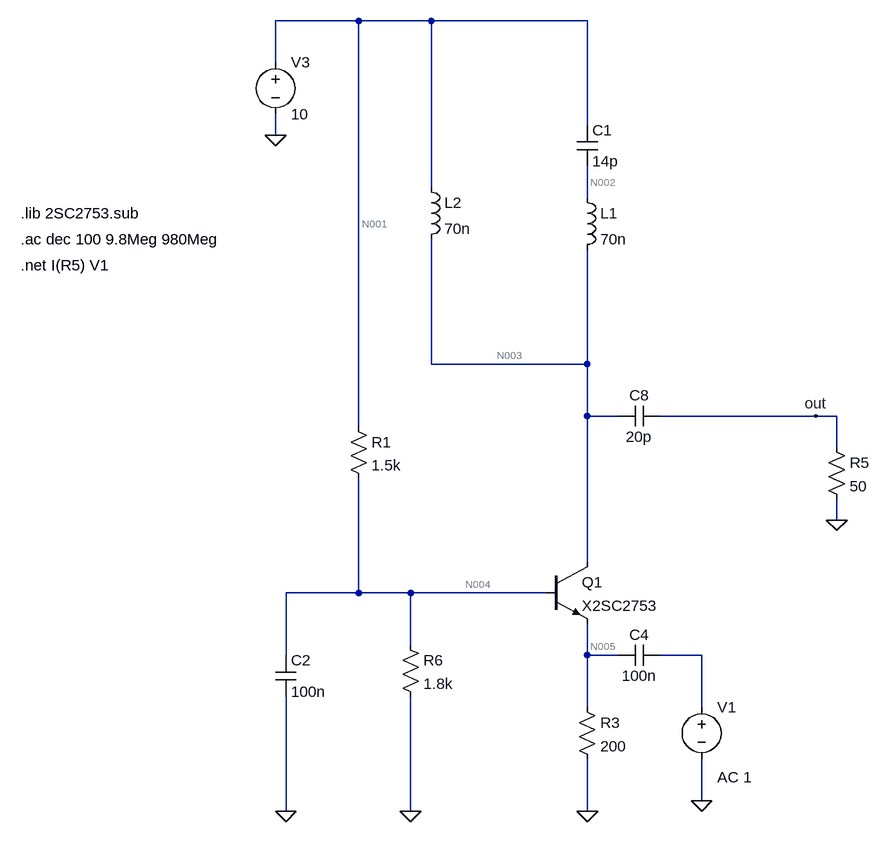
[diagram p0: schematic narrowband.asc]
narrowband.asc, the LTspice schematic file:
Version 4
SHEET 1 1396 724
WIRE -96 -608 -224 -608
WIRE 16 -608 -96 -608
WIRE 256 -608 16 -608
WIRE -224 -544 -224 -608
WIRE 256 -448 256 -608
WIRE -224 -432 -224 -464
WIRE 16 -352 16 -608
WIRE 256 -336 256 -384
WIRE 16 -80 16 -272
WIRE 256 -80 256 -256
WIRE 256 -80 16 -80
WIRE 256 0 256 -80
WIRE 304 0 256 0
WIRE 608 0 368 0
WIRE 640 0 608 0
WIRE -96 16 -96 -608
WIRE 640 48 640 0
WIRE 640 160 640 128
WIRE 256 224 256 0
WIRE -96 272 -96 96
WIRE -96 272 -208 272
WIRE -16 272 -96 272
WIRE 192 272 -16 272
WIRE -16 352 -16 272
WIRE -208 368 -208 272
WIRE 256 368 256 320
WIRE 304 368 256 368
WIRE 432 368 368 368
WIRE 256 448 256 368
WIRE 432 448 432 368
WIRE 432 592 432 528
WIRE -208 608 -208 432
WIRE -16 608 -16 432
WIRE 256 608 256 528
FLAG -224 -432 0
FLAG -16 608 0
FLAG 608 0 out
FLAG 432 592 0
FLAG 640 160 0
FLAG -208 608 0
FLAG 256 608 0
SYMBOL ind 240 -352 R0
SYMATTR InstName L1
SYMATTR Value 70n
SYMBOL npn 192 224 R0
SYMATTR InstName Q1
SYMATTR Value X2SC2753
SYMATTR Prefix X1
SYMBOL voltage -224 -560 R0
WINDOW 123 0 0 Left 0
WINDOW 39 0 0 Left 0
SYMATTR InstName V3
SYMATTR Value 10
SYMBOL res -32 336 R0
SYMATTR InstName R6
SYMATTR Value 1.8k
SYMBOL cap 368 -16 R90
WINDOW 0 0 32 VBottom 2
WINDOW 3 32 32 VTop 2
SYMATTR InstName C8
SYMATTR Value 20p
SYMBOL cap 368 352 R90
WINDOW 0 0 32 VBottom 2
WINDOW 3 32 32 VTop 2
SYMATTR InstName C4
SYMATTR Value 100n
SYMBOL res 624 32 R0
SYMATTR InstName R5
SYMATTR Value 50
SYMBOL voltage 432 432 R0
WINDOW 123 24 124 Left 2
WINDOW 39 24 152 Left 2
SYMATTR Value2 AC 1
SYMATTR InstName V1
SYMATTR Value ""
SYMBOL res -112 0 R0
SYMATTR InstName R1
SYMATTR Value 1.5k
SYMBOL cap -224 368 R0
SYMATTR InstName C2
SYMATTR Value 100n
SYMBOL res 240 432 R0
SYMATTR InstName R3
SYMATTR Value 200
SYMBOL ind 0 -368 R0
SYMATTR InstName L2
SYMATTR Value 70n
SYMBOL cap 240 -448 R0
SYMATTR InstName C1
SYMATTR Value 14p
TEXT -616 -312 Left 2 !.lib 2SC2753.sub
TEXT -616 -272 Left 2 !.ac dec 100 9.8Meg 980Meg
TEXT -616 -232 Left 2 !.net I(R5) V1

The netlist it stands for:
* narrowband.asc
L1 N002 N003 70n
XQ1 N003 N004 N005 X2SC2753  ; pins C B E
V3 N001 0 10
R6 N004 0 1.8k
C8 out N003 20p
C4 N006 N005 100n
R5 out 0 50
V1 N006 0 AC 1
R1 N001 N004 1.5k
C2 N004 0 100n
R3 N005 0 200
L2 N001 N003 70n
C1 N001 N002 14p
.lib 2SC2753.sub
.ac dec 100 9.8Meg 980Meg
.net I(R5) V1
.backanno
.end

* Results of the author's LTspice run, read from the files saved beside the schematic
* Operating Point, zero values left out:
*   V(n002) = 10 V
*   V(n003) = 10 V
*   V(n004) = 5.218 V
*   V(n005) = 4.368 V
*   V(n001) = 10 V
*   I(L2) = 21.55 mA
*   I(R3) = 21.84 mA
*   I(R1) = 3.188 mA
*   I(R6) = 2.899 mA
*   I(V3) = -24.74 mA
*   Ix(q1:C1) = 21.55 mA
*   Ix(q1:B1) = 289 µA
*   Ix(q1:E1) = -21.84 mA
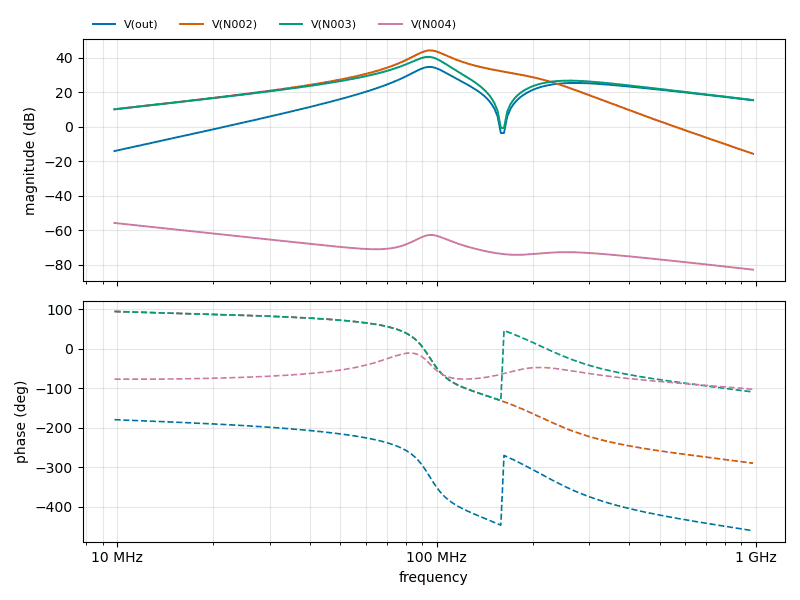
[diagram p1: AC Analysis of narrowband.asc, plotted from the saved traces]
* AC Analysis, 1 run:
*   V(out): -14.06 dB at 9.8 MHz, 15.41 dB at 980 MHz, peak 34.79 dB at 95.77 MHz, 3 dB below the peak at 85.24 MHz and 105.8 MHz
*   V(N002): 10.20 dB at 9.8 MHz, -15.64 dB at 980 MHz, peak 44.35 dB at 95.77 MHz, 3 dB below the peak at 85.61 MHz and 107.3 MHz
*   V(N003): 10.17 dB at 9.8 MHz, 15.53 dB at 980 MHz, peak 40.62 dB at 93.59 MHz, 3 dB below the peak at 83.56 MHz and 104.3 MHz
*   V(N004): -55.77 dB at 9.8 MHz, -82.88 dB at 980 MHz, peak -55.77 dB at 9.8 MHz, 3 dB below the peak at 13.92 MHz